# EAGLE design ESP12_PwmBoard (EAGLE 9.6.2)

## Sheet 1 of 2
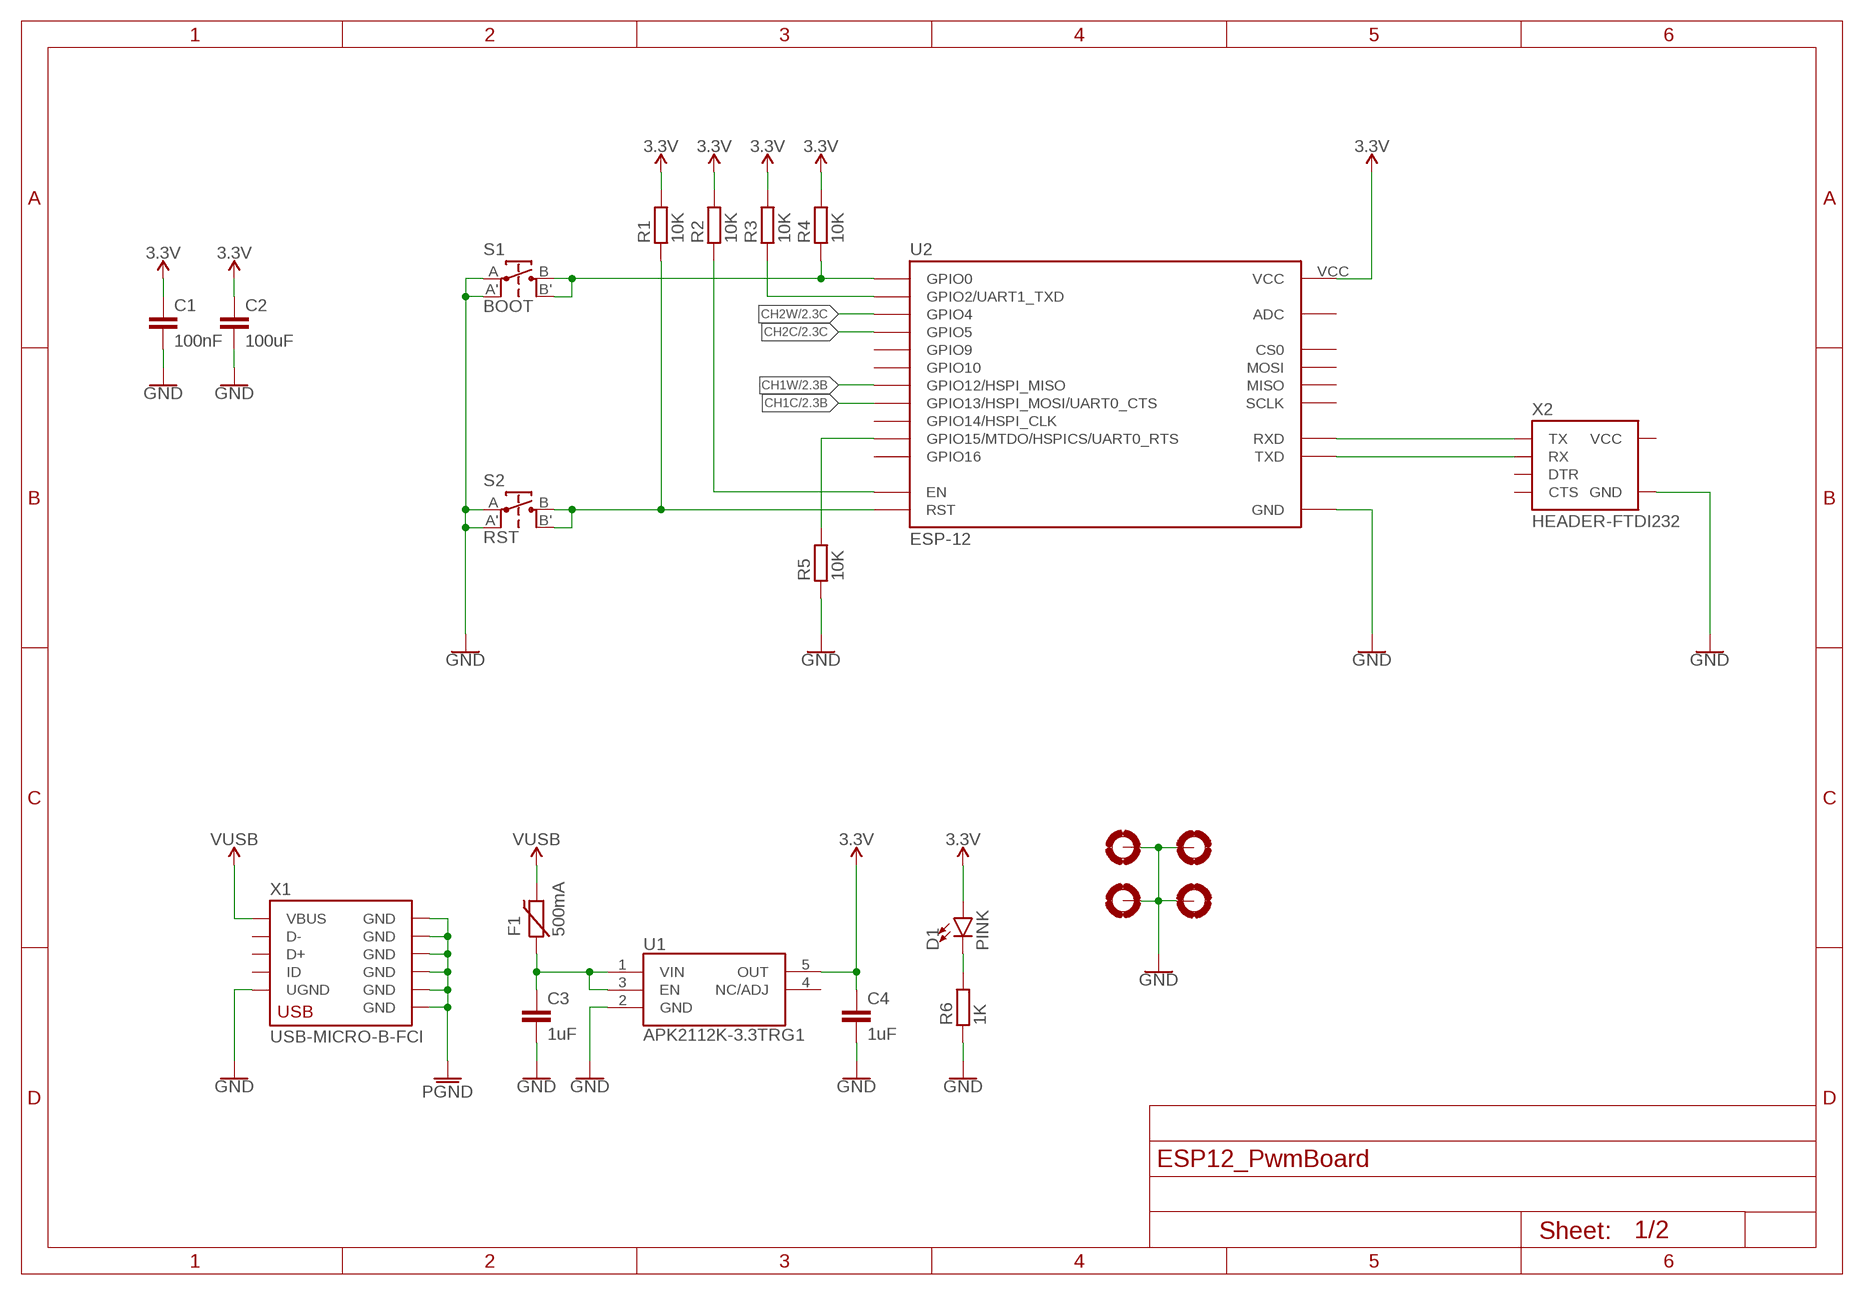
[diagram p0: schematic, sheet 1]

### Parts
C1  100nF  CAPC0603  [C0603]
C2  100uF  CAPC0603  [C0603]
C3  1uF  CAPC0603  [C0603]
C4  1uF  CAPC0603  [C0603]
D1  PINK  LED0603  [LED0603]
F1  500mA  PTC0ZCJ  [PTC-0ZCJ-1206]
H1  MOUNTHOLE-PAD3.2  [3.2-PAD]
H2  MOUNTHOLE-PAD3.2  [3.2-PAD]
H3  MOUNTHOLE-PAD3.2  [3.2-PAD]
H4  MOUNTHOLE-PAD3.2  [3.2-PAD]
R1  10K  RESISTOR0603  [R0603]
R2  10K  RESISTOR0603  [R0603]
R3  10K  RESISTOR0603  [R0603]
R4  10K  RESISTOR0603  [R0603]
R5  10K  RESISTOR0603  [R0603]
R6  1K  RESISTOR0603  [R0603]
S1  BOOT  TACT-SWITCH-EVQEVQ-Q2Y03W  [TACT-SWITCH-EVQ]
S2  RST  TACT-SWITCH-EVQEVQ-Q2Y03W  [TACT-SWITCH-EVQ]
U1  APK2112K-3.3TRG1  REGULATOR-AP2112KK-SOT23-5  [SOT23-5]
U2  ESP-12  ESP-12E  [ESP-12E]
X1  USB-MICRO-B-FCI  [USB-MICRO-B-FCI]
X2  HEADER-FTDI232  [FTDI232-1X06]

### Nets
3.3V: C1.1 C2.1 C4.1 D1.A R1.2 R2.2 R3.2 R4.2 U1.5(OUT) U2.VCC
CH1C: U2.GPIO13(GPIO13/HSPI_MOSI/UART0_CTS) ; also sheet 2
CH1W: U2.GPIO12(GPIO12/HSPI_MISO) ; also sheet 2
CH2C: U2.GPIO5 ; also sheet 2
CH2W: U2.GPIO4 ; also sheet 2
GND: C1.2 C2.2 C3.2 C4.2 H1.B3,2(MOUNT) H2.B3,2(MOUNT) H3.B3,2(MOUNT) H4.B3,2(MOUNT) R5.1 R6.1 S1.A S1.A' S2.A S2.A' U1.2(GND) U2.GND X1.5(UGND) X2.GND ; also sheet 2
N$1: R4.1 S1.B S1.B' U2.GPIO0
N$2: R1.1 S2.B S2.B' U2.RST
N$3: R2.1 U2.EN
N$4: C3.1 F1.1 U1.1(VIN) U1.3(EN)
N$5: R3.1 U2.GPIO2(GPIO2/UART1_TXD)
N$6: U2.RXD X2.TX
N$7: U2.TXD X2.RX
N$8: D1.C R6.2
N$9: R5.2 U2.GPIO15(GPIO15/MTDO/HSPICS/UART0_RTS)
PGND: X1.GND@1(GND) X1.GND@2(GND) X1.GND@3(GND) X1.GND@4(GND) X1.GND@5(GND) X1.GND@6(GND)
VUSB: F1.2 X1.1(VBUS)
Unconnected: U1.4(NC/ADJ) U2.ADC U2.CS0 U2.GPIO9 U2.GPIO10 U2.GPIO14(GPIO14/HSPI_CLK) U2.GPIO16 U2.MISO U2.MOSI U2.SCLK X1.2(D-) X1.3(D+) X1.4(ID) X2.CTS X2.DTR

## Sheet 2 of 2
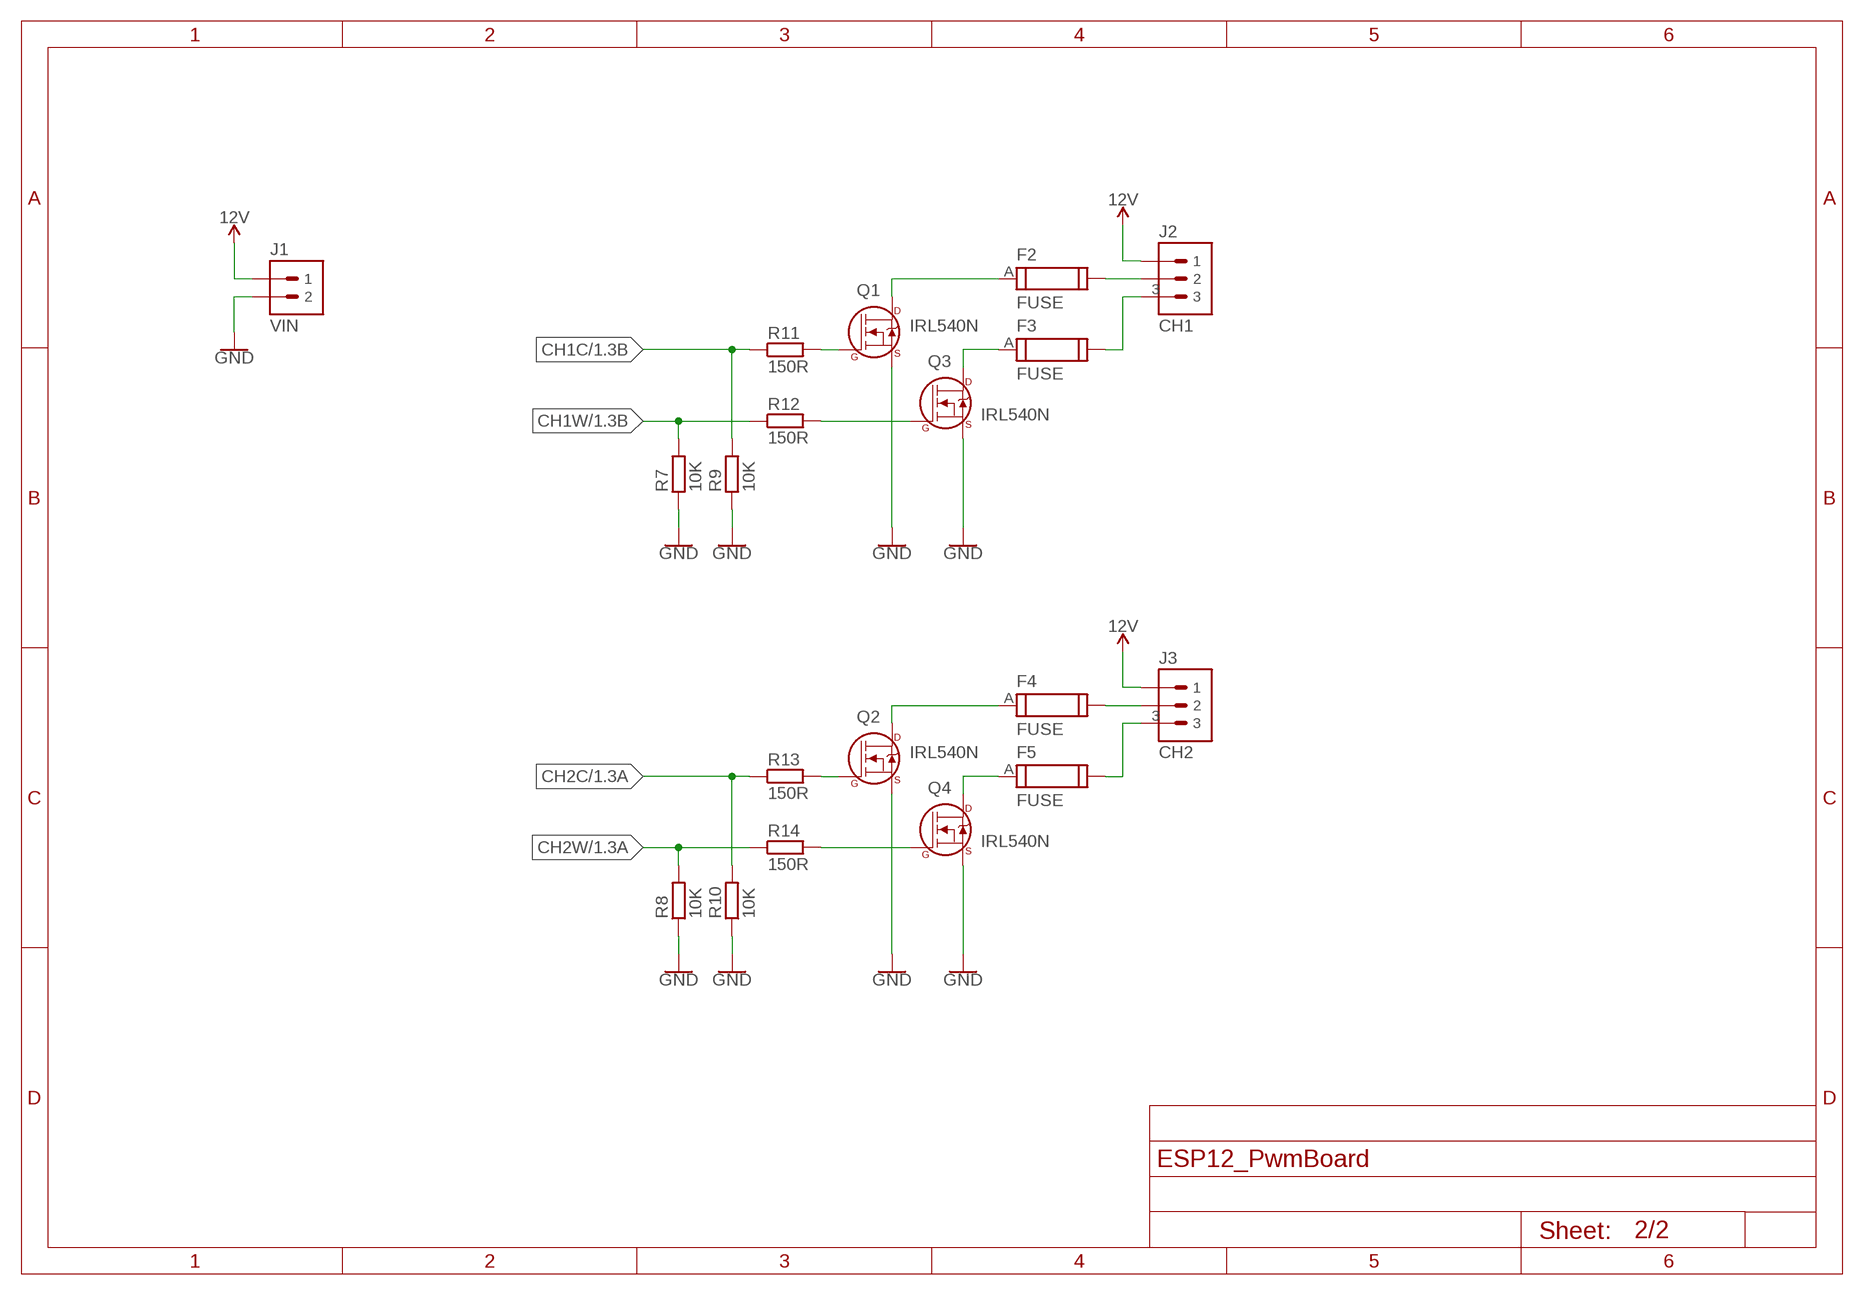
[diagram p1: schematic, sheet 2]

### Parts
F2  FUSE  FUSETEAL  [FUSE-TEAL]
F3  FUSE  FUSETEAL  [FUSE-TEAL]
F4  FUSE  FUSETEAL  [FUSE-TEAL]
F5  FUSE  FUSETEAL  [FUSE-TEAL]
J1  VIN  TERMINAL-1X02-5.08OSTTC022162  [ONSHORE-OSTTC022162]
J2  CH1  TERMINAL-1X03-5.08OSTTC032162  [ONSHORE-OSTTC032162]
J3  CH2  TERMINAL-1X03-5.08OSTTC032162  [ONSHORE-OSTTC032162]
Q1  IRL540N  MOSFET-NCHTO-220AB  [TO-220AB]
Q2  IRL540N  MOSFET-NCHTO-220AB  [TO-220AB]
Q3  IRL540N  MOSFET-NCHTO-220AB  [TO-220AB]
Q4  IRL540N  MOSFET-NCHTO-220AB  [TO-220AB]
R7  10K  RESISTOR0603  [R0603]
R8  10K  RESISTOR0603  [R0603]
R9  10K  RESISTOR0603  [R0603]
R10  10K  RESISTOR0603  [R0603]
R11  150R  RESISTOR0603  [R0603]
R12  150R  RESISTOR0603  [R0603]
R13  150R  RESISTOR0603  [R0603]
R14  150R  RESISTOR0603  [R0603]

### Nets
12V: J1.1 J2.1 J3.1
CH1C: R9.2 R11.1 ; also sheet 1
CH1W: R7.2 R12.1 ; also sheet 1
CH2C: R10.2 R13.1 ; also sheet 1
CH2W: R8.2 R14.1 ; also sheet 1
GND: J1.2 Q1.3(S) Q2.3(S) Q3.3(S) Q4.3(S) R7.1 R8.1 R9.1 R10.1 ; also sheet 1
N$10: Q3.1(G) R12.2
N$11: Q1.1(G) R11.2
N$12: F3.A Q3.2(D)
N$13: F2.A Q1.2(D)
N$14: F3.B J2.3
N$15: F2.B J2.2
N$16: Q4.1(G) R14.2
N$17: Q2.1(G) R13.2
N$18: F5.A Q4.2(D)
N$19: F4.A Q2.2(D)
N$20: F5.B J3.3
N$21: F4.B J3.2

## Power pins joined to a net without a drawn wire
VCC: X2.VCC

## Library data of the parts
C1-C4 = M2M-Passives:CAP
D1 = M2M-LED:LED: LED (Generic) Standard schematic elements and footprints for 5mm, 3mm, 1206, and 0603 sized LEDs. Generic LEDs with no color specified.
F1 = M2M-Fuse:PTC
F2-F5 = M2M-Power:FUSE
H1-H4 = M2M-Holes:MOUNTHOLE-PAD
J1 = M2M-Connectors:TERMINAL-1X02-5.08: https://www.digikey.se/product-detail/sv/on-shore-technology-inc/OSTTC022162/ED2609-ND/614558
J2 J3 = M2M-Connectors:TERMINAL-1X03-5.08
Q1-Q4 = M2M-DiscreteSemi:MOSFET-NCH
R1-R14 = M2M-Passives:RESISTOR
S1 S2 = M2M-Switches:TACT-SWITCH-EVQ
U1 = M2M-IC:REGULATOR-AP2112K
U2 = M2M-Modules:ESP-12E
X1 = M2M-Connectors:USB-MICRO-B-FCI: FCI-10118192-0001LF 609-4613-1-ND
X2 = M2M-Connectors:HEADER-FTDI232

## Board
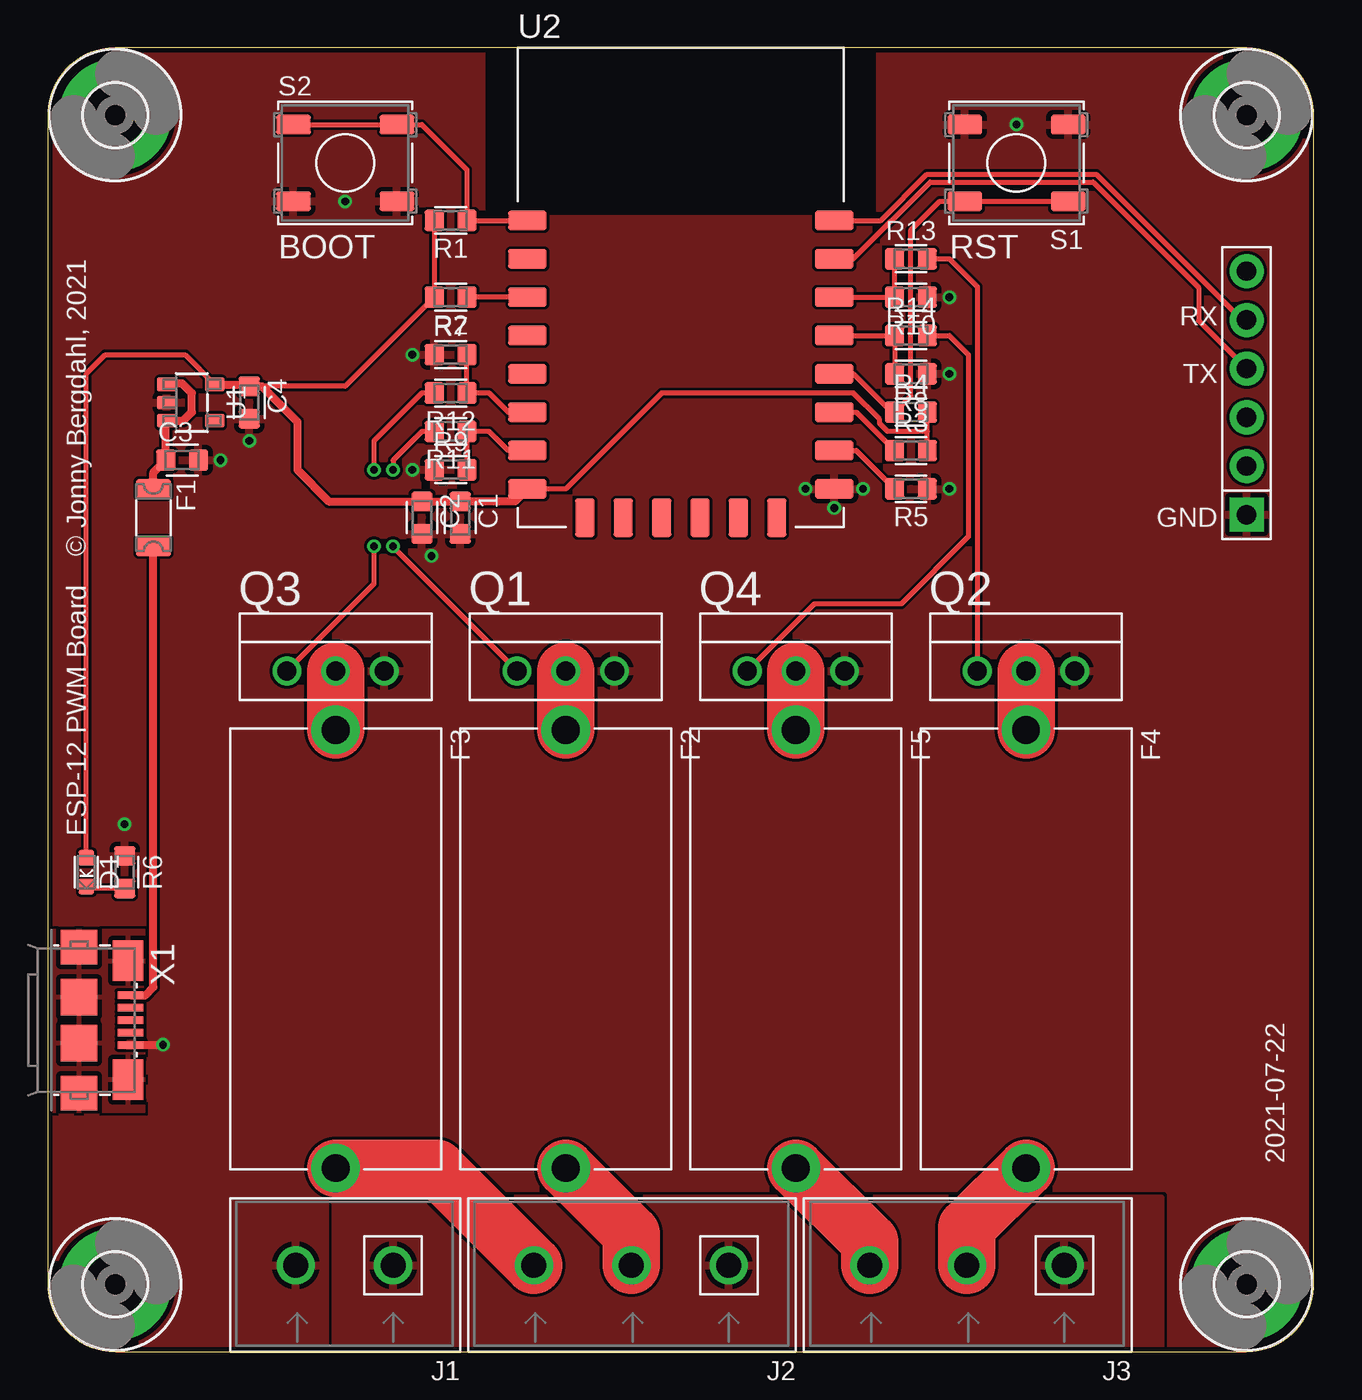
[diagram p2: board, top side]
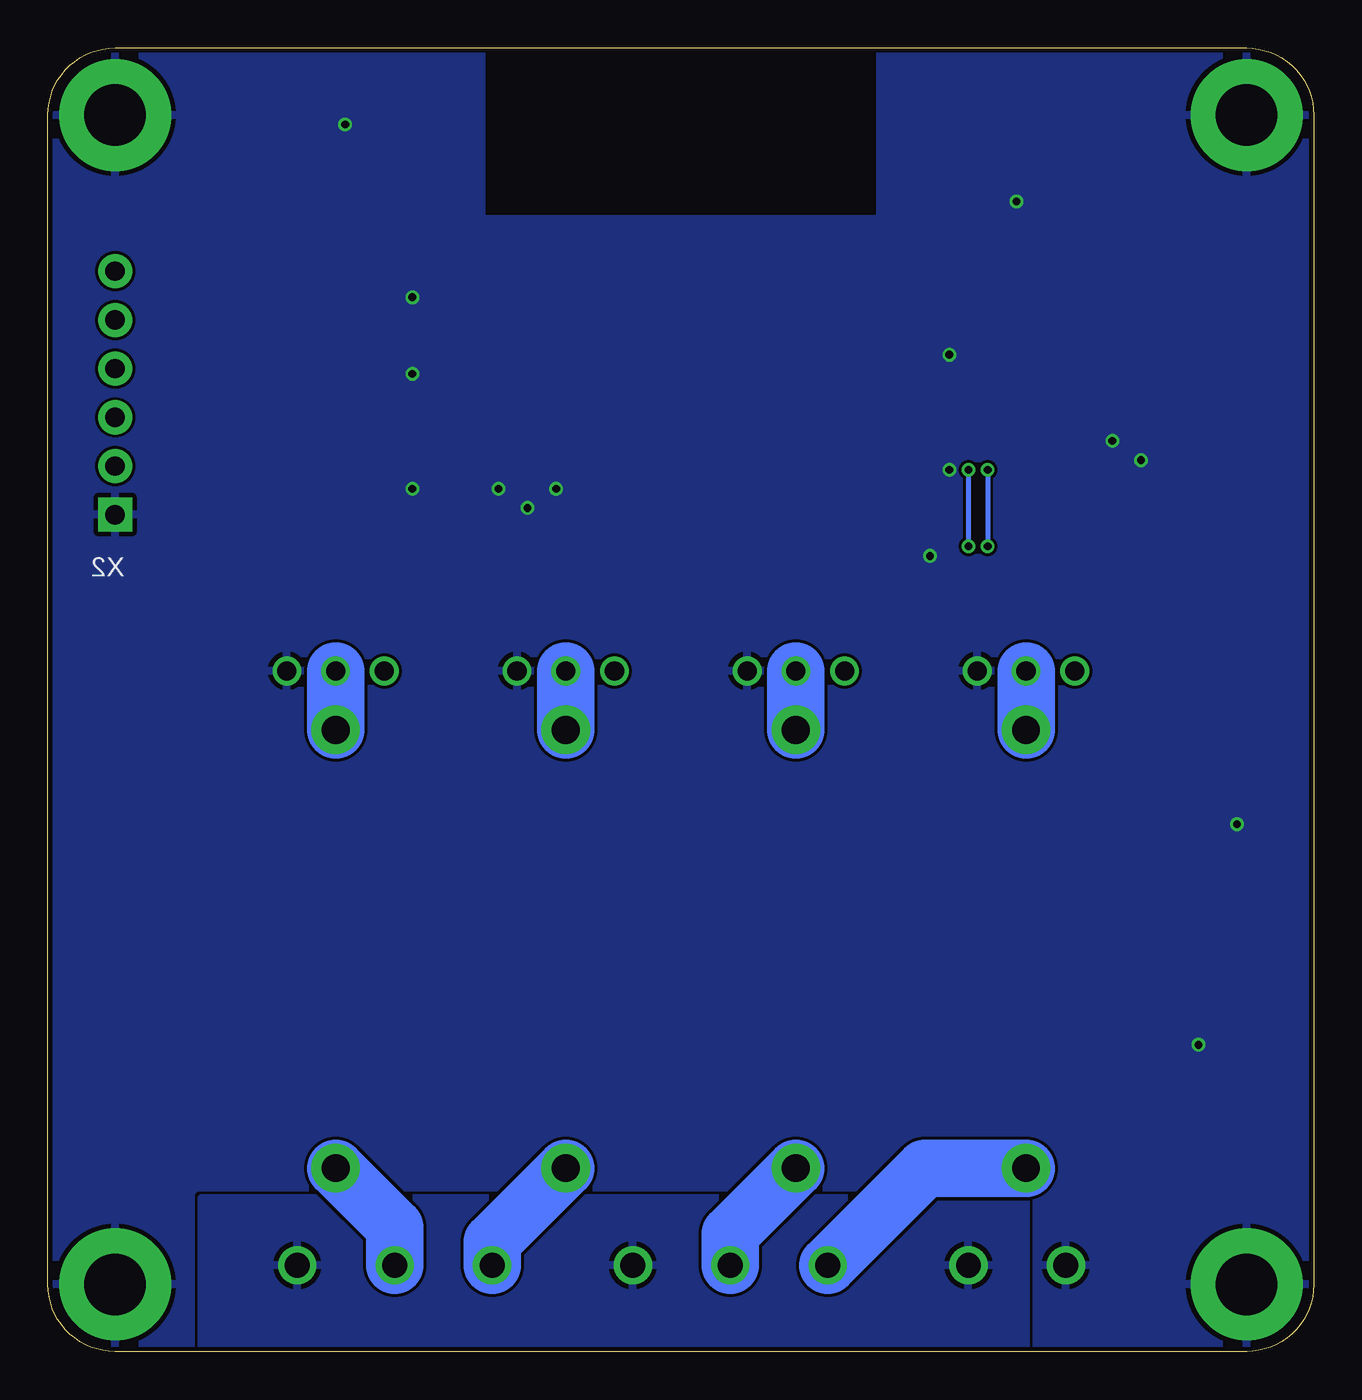
[diagram p3: board, bottom side, seen from below]

Size 66 x 68 mm. Coordinates in mm from the lower left corner, seen from the top.
Outline: 62.5,68 3.5,68 arc90 0,64.5 0,3.5 arc90 3.5,0 62.5,0 arc90 66,3.5 66,64.5 arc90 62.5,68
Copper layers (1*16): Top 0.035mm / dielectric 1.5mm / Bottom 0.035mm
Design rules "SeeedStudio_2layer_DRU_no_angle_20140221": minimum track width 6mil, minimum drill 0.3mm, track to track 6mil, track to pad 6mil, pad to pad 6mil, via to via 6mil, smd to smd 0mil, copper to edge 10mil, drill to drill 10mil, minimum pad ring 2mil, minimum via ring 6mil, stop-mask expansion 2mil, vias tented up to drill 1000mil, thermal gap 10mil

### Footprints (pad centres in the part's own frame; a part is rotated, then mirrored left to right if it is on the bottom)
C0603 = smd 1 x 1.1: 1 -0.85,0; 2 0.85,0
LED0603 = smd 0.8 x 0.8: A -0.75,0; C 0.75,0
PTC-0ZCJ-1206 = smd 1 x 1.8: 1 -1.5,0; 2 1.5,0
FUSE-TEAL = drill 1.45 pad 2.54: A -11.43,0; B 11.43,0
3.2-PAD = drill 3.2 pad 5.842: B3,2 0,0
ONSHORE-OSTTC022162 = drill 1.3 pad 2: 1 0,0; 2 5.08,0
ONSHORE-OSTTC032162 = drill 1.3 pad 2: 1 0,0; 2 5.08,0; 3 10.16,0
TO-220AB = drill 1: 1 -2.54,0; 2 0,0; 3 2.54,0
R0603 = smd 1 x 1.1: 1 -0.85,0; 2 0.85,0
TACT-SWITCH-EVQ = smd 1.8 x 1: A -2.7,-2; A' 2.7,-2; B -2.7,2; B' 2.7,2
SOT23-5 = smd 0.7 x 1: 1 -0.95,-1.3; 2 0,-1.3; 3 0.95,-1.3; 4 0.95,1.2; 5 -0.95,1.2
ESP-12E = smd 2 x 1: ADC -8,1.5; EN -8,-0.5; GND 8,-10.5; GPIO0 8,-4.5; GPIO2 8,-6.5; GPIO4 8,-2.5; GPIO5 8,-0.5; GPIO12 -8,-6.5; GPIO13 -8,-8.5; GPIO14 -8,-4.5; GPIO15 8,-8.5; GPIO16 -8,-2.5; RST -8,3.5; RXD 8,1.5; TXD 8,3.5; VCC -8,-10.5 | smd 1 x 2: CS0 -5,-12; GPIO9 -1,-12; GPIO10 1,-12; MISO -3,-12; MOSI 3,-12; SCLK 5,-12
USB-MICRO-B-FCI = smd 0.4 x 1.35: 1 -1.3,2.675; 2 -0.65,2.675; 3 0,2.675; 4 0.65,2.675; 5 1.3,2.675 | smd 2.1 x 1.6: GND@1 -3.1,2.55; GND@2 3.1,2.55 | smd 1.8 x 1.9: GND@3 -3.8,0; GND@6 3.8,0 | smd 1.9 x 1.9: GND@4 -1.2,0; GND@5 1.2,0
FTDI232-1X06 = drill 1 pad 1.778: CTS 0,3.81; DTR 0,-6.35; RX 0,-3.81; TX 0,-1.27; VCC 0,1.27 | drill 1 pad 1.778 square: GND 0,6.35

### Placement (x,y rotation side)
C1  21.5,43.5 270 top
C2  19.5,43.5 270 top
C3  7,46.5 0 top
C4  10.5,49.5 270 top
D1  2,25 270 top
F1  5.5,43.5 270 top
F2  27,21 270 top
F3  15,21 270 top
F4  51,21 270 top
F5  39,21 270 top
H1  62.5,3.5 0 top
H2  3.5,3.5 0 top
H3  3.5,64.5 0 top
H4  62.5,64.5 0 top
J1  18,4.5 180 top
J2  35.5,4.5 180 top
J3  53,4.5 180 top
Q1  27,35.5 0 top
Q2  51,35.5 0 top
Q3  15,35.5 0 top
Q4  39,35.5 0 top
R1  21,59 180 top
R2  21,55 180 top
R3  45,47 0 top
R4  45,49 0 top
R5  45,45 180 top
R6  4,25 270 top
R7  21,52 0 top
R8  45,51 180 top
R9  21,46 0 top
R10  45,55 180 top
R11  21,48 180 top
R12  21,50 180 top
R13  45,57 0 top
R14  45,53 0 top
S1  50.5,62 180 top
S2  15.5,62 0 top
U1  7.5,49.5 270 top
U2  33,55.5 0 top
X1  1.63,17.29 270 top
X2  62.5,50 180 top

### Tracks (layer width: path | path; a pad name or v marks a point on that pad's centre or on a via)
3.3V
  Top 0.254: D1.A 2,51 3,52 7.15,52 U1.5 | R1.2 R2.2 15.5,50.35 11,50.35 | R3.2 45.85,48 | 45.85,48 R4.2 | U2.VCC 27,45 32,50 42,50 43.37,48.63 43.37,48.41 43.78,48 45.85,48
  Top 0.406: U1.5 10.4,50.45 C4.1 11,50.35 11.15,50.35 13,48.5 13,46 14.65,44.35 C2.1 C1.1 24.35,44.35 U2.VCC
12V
  pour Top: 15,8 58,8 58,0 15,0
  pour Bottom: 15,0 15,8 58,8 58,0
CH1C
  Top 0.254: U2.GPIO13 24,47 23,48 R11.1 R9.2
CH1W
  Top 0.254: U2.GPIO12 24,49 23,50 R12.1 R7.2
CH2C
  Top 0.254: U2.GPIO5 R10.2 R13.1
CH2W
  Top 0.254: U2.GPIO4 R14.1 R8.2
GND  (via drill 0.4)
  Top 0.406: X1.5 v6,15.99 v6,16
  other vias: 4,27.5 19,46 19,52 20,41.5 9,46.5 10.5,47.5 15.5,60 47,45 47,51 47,55 50.5,64 42.5,45 41,44 39.5,45
  pour Top (rank 5): 0,68 66,68 66,0 0,0
  pour Bottom (rank 4): 0,0 0,68 66,68 66,0
N$1
  Top 0.254: U2.GPIO0 42,51 44,49 R4.1 45,49.85 45,58.5 46.5,60 S1.B' S1.B
N$2
  Top 0.254: S2.B S2.B' 19.5,64 21.85,61.65 R1.1 U2.RST
N$3
  Top 0.254: U2.EN R2.1
N$4
  Top 0.406: U1.1 6.25,50.5 7,50.5 7.5,50 7.5,49 7.05,48.55 U1.3 6.15,48.5 C3.1 5.5,45.85 F1.1
N$5
  Top 0.254: R3.1 42.15,49 U2.GPIO2
N$6
  Top 0.254: U2.RXD 42,57 46,61 54.5,61 60,55.5 60,53.77 X2.TX
N$7
  Top 0.254: U2.TXD 43.42,59 45.83,61.41 54.67,61.41 62.27,53.81 X2.RX
N$8
  Top 0.254: R6.2 2.1,24.15 D1.C
N$9
  Top 0.254: R5.2 42.15,47 U2.GPIO15
N$10  (via drill 0.4)
  Top 0.254: R12.2 19.5,50 17,47.5 v17,46 | v17,42 17,40.04 Q3.1
  Bottom 0.254: v17,46 v17,42
N$11  (via drill 0.4)
  Top 0.254: R11.2 19.5,48 18,46.5 v18,46 | v18,42 18,41.96 Q1.1
  Bottom 0.254: v18,46 v18,42
N$12
  Top 3: Q3.2 F3.A
  Bottom 3: Q3.2 F3.A
N$13
  Top 3: Q1.2 F2.A
  Bottom 3: Q1.2 F2.A
N$14
  Top 3: F3.B 20.27,9.57 J2.3
  Bottom 3: F3.B 20.27,9.57 J2.3
N$15
  Top 3: F2.B 30.42,6.15 J2.2
  Bottom 3: F2.B 30.42,6.15 J2.2
N$16
  Top 0.254: R14.2 47,53 48,52 48,42.5 44.5,39 39.96,39 Q4.1
N$17
  Top 0.254: R13.2 47,57 48.46,55.54 Q2.1
N$18
  Top 3: Q4.2 F5.A
  Bottom 3: Q4.2 F5.A
N$19
  Top 3: Q2.2 F4.A
  Bottom 3: Q2.2 F4.A
N$20
  Top 3: F5.B 42.84,5.73 J3.3
  Bottom 3: F5.B 42.84,5.73 J3.3
N$21
  Top 3: F4.B 47.92,6.49 J3.2
  Bottom 3: F4.B 47.92,6.49 J3.2
PGND
  pour Top: 0,22 5,22 5,12.5 0,12.5
VUSB
  Top 0.406: X1.1 5.09,18.59 5.5,19 F1.2

### Text on the board
tPlace: © Jonny Bergdahl, 2021 | BOOT | RST | RX | TX | GND | ESP-12 PWM Board | 2021-07-22